# EAGLE schematic CarDisplay (EAGLE 6.6.0)
CNAME: Gabor Simon
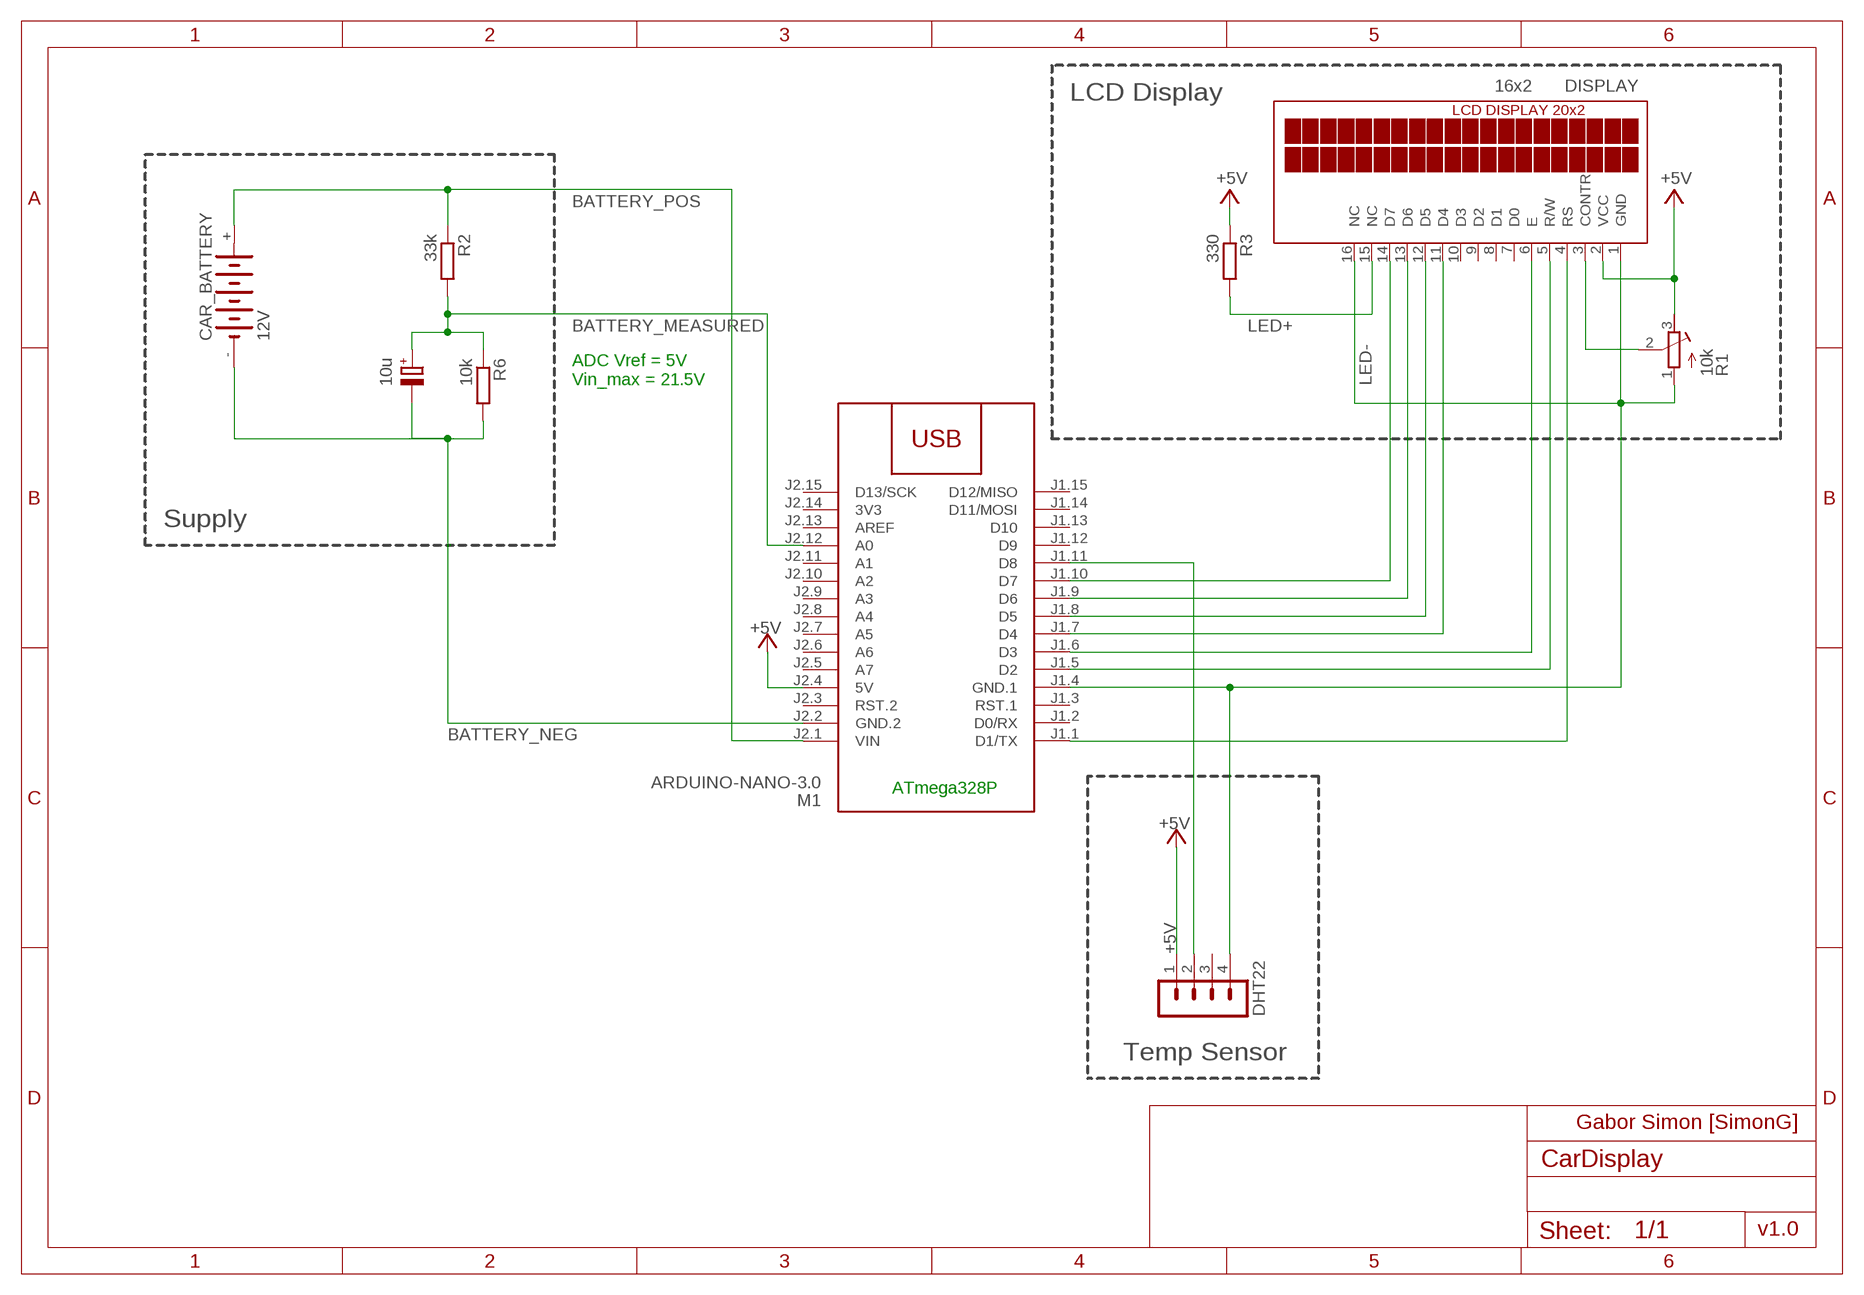
[diagram p0: schematic, sheet 1]

## Parts
C4  10u  CPOL-EUE5-8.5  [E5-8,5]
CAR_BATTERY  12V  5V280R  [5V280R]
DHT22  MA04-1  [MA04-1]
DISPLAY  16x2  TUXGR_20X2  [TUXGR_20X2]
M1  ARDUINO-NANO-3.0  [ARDUINO-NANO-3.0]
R1  10k  R-TRIMM3202  [RTRIM3202]
R2  33k  R-EU_0204/7  [0204/7]
R3  330  R-EU_0204/7  [0204/7]
R6  10k  R-EU_0204/7  [0204/7]

## Nets
+5V: DHT22.1 DISPLAY.2(VCC) M1.J2.4(5V) R1.3(A) R3.1
BATTERY_MEASURED: C4.+ M1.J2.12(A0) R2.2 R6.1
BATTERY_NEG: CAR_BATTERY.- M1.J2.2(GND.2) R6.2
BATTERY_POS: CAR_BATTERY.+ M1.J2.1(VIN) R2.1
LED+: DISPLAY.15(NC) R3.2
LED-: DHT22.4 DISPLAY.1(GND) DISPLAY.16(NC) M1.J1.4(GND.1) R1.1(E)
N$1: DISPLAY.6(E) M1.J1.6(D3)
N$2: DISPLAY.5(R/W) M1.J1.5(D2)
N$3: DISPLAY.4(RS) M1.J1.1(D1/TX)
N$4: DISPLAY.14(D7) M1.J1.10(D7)
N$5: DISPLAY.13(D6) M1.J1.9(D6)
N$6: DISPLAY.12(D5) M1.J1.8(D5)
N$7: DISPLAY.11(D4) M1.J1.7(D4)
N$8: DHT22.2 M1.J1.11(D8)
N$10: C4.-
N$14: DISPLAY.3(CONTR) R1.2(S)
Unconnected: CAR_BATTERY.+@1(+) DHT22.3 DISPLAY.7(D0) DISPLAY.8(D1) DISPLAY.9(D2) DISPLAY.10(D3) M1.J1.2(D0/RX) M1.J1.3(RST.1) M1.J1.12(D9) M1.J1.13(D10) M1.J1.14(D11/MOSI) M1.J1.15(D12/MISO) M1.J2.3(RST.2) M1.J2.5(A7) M1.J2.6(A6) M1.J2.7(A5) M1.J2.8(A4) M1.J2.9(A3) M1.J2.10(A2) M1.J2.11(A1) M1.J2.13(AREF) M1.J2.15(D13/SCK)

## Notes on the sheet
- LCD Display
- ADC Vref = 5V
  Vin_max = 21.5V
- Supply
- ATmega328P
- Temp Sensor
- Gabor Simon [SimonG]
- v1.0

## Power pins joined to a net without a drawn wire
3V3: M1.J2.14(3V3)

## Library data of the parts
C4 = rcl:CPOL-EU: POLARIZED CAPACITOR, European symbol
CAR_BATTERY = battery:5V280R: NC ACCU Varta
DHT22 = con-lstb:MA04-1: PIN HEADER; OC_FARNELL: unknown; OC_NEWARK: unknown
DISPLAY = display-lcd:TUXGR_20X2: Tuxgraphics LCD display 20x2 characters reflective, without background light Source: tuxgr_20x2.pdf; OC_FARNELL: unknown; OC_NEWARK: unknown
M1 = diy-modules:ARDUINO-NANO-3.0: Arduino Nano 3.0 and compatible devices More details available here: https://www.arduino.cc/en/Main/ArduinoBoardNano Click here to find device on ebay.com <http://www.ebay.com/sch/arduino+nano>
R1 = resistor:R-TRIMM: Trimm resistor
R2 R3 R6 = rcl:R-EU_: RESISTOR, European symbol